# Altium project MCU098_LP-MSPM0G3507.PrjPcb (part 3 of 4)

## Sheet MCU098_04_XDS110-ET_EnergyTrace.SchDoc: XDS110-ET EnergyTrace
size 431 x 279 mm; Date: Not shown in title block; ApprovedBy: Not shown in title block; CheckedBy: Not shown in title block; Author: Not shown in title block; CompanyName: Not shown in title block; DrawnBy: Johnson He; Engineer: Not shown in title block; Organization: Not shown in title block; Address1: Not shown in title block; Address2: Not shown in title block; Address3: Not shown in title block; Address4: Not shown in title block; DocumentNumber: 2; Revision: Use project parameter SCH_Rev; SheetNumber: 4; SheetTotal: 7; PageSetup: Record=PageOptions|CenterHorizontal=True|CenterVertical=True|PrintScale=1.00|XCorrection=1.00|YCorrection=1.00|PrintKind=0|BorderSize=5000000|LeftOffset=0|BottomOffset=0|Orientation=2|PaperLength=1000|PaperWidth=1000|Scale=100|PaperSource=15|PrintQuality=600|MediaType=1|DitherType=10|PaperKind=Letter|PrintScaleMode=1; CurrentTime: Not shown in title block; CurrentDate: Not shown in title block; Time: Not shown in title block; DocumentFullPathAndName: Not shown in title block; DocumentName: Not shown in title block; ModifiedDate: Not shown in title block; ImagePath: Not shown in title block
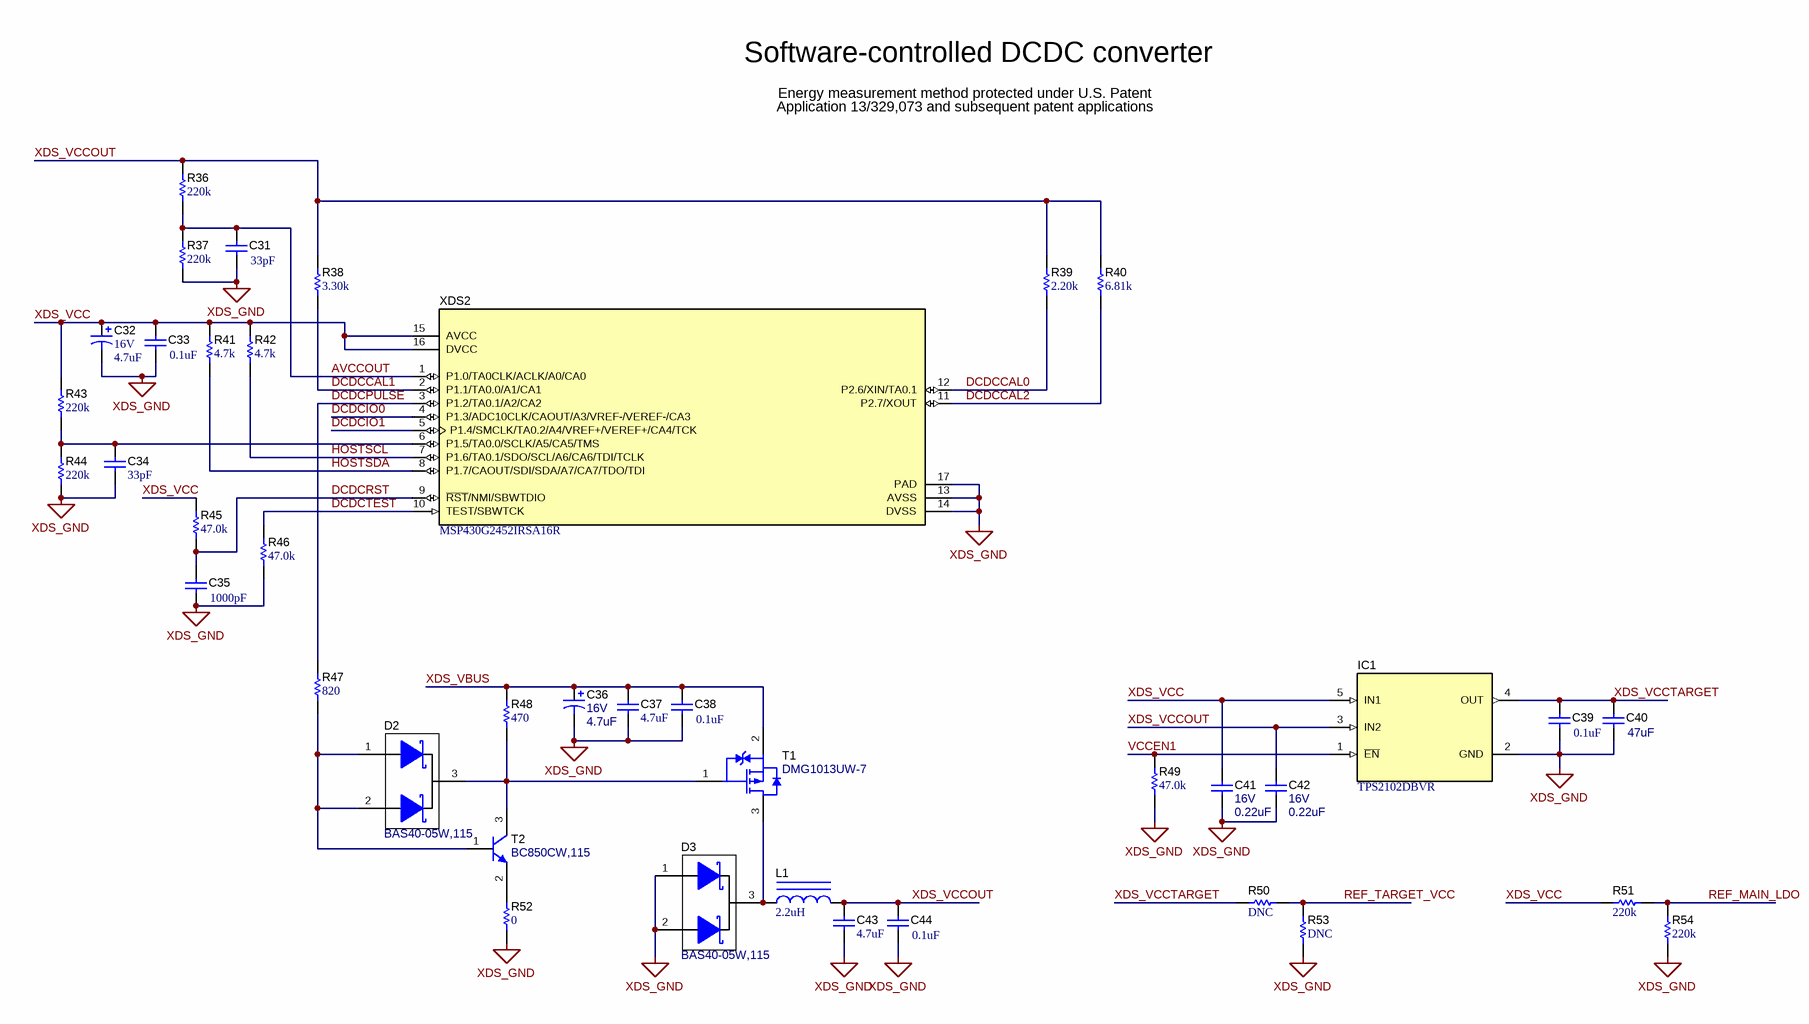
[diagram p3: MCU098_04_XDS110-ET_EnergyTrace.SchDoc]

### Parts
C31  ValueDisplayed: 33pF  [0402]  (hidden comment: GRM1555C1H330JA01D)
C32  VDC_V: 16V  ValueDisplayed: 4.7uF  [3216-18]  (hidden comment: TAJA475K016RNJ)
C33  ValueDisplayed: 0.1uF  [0402]  (hidden comment: GRM155R70J104KA01D)
C34  ValueDisplayed: 33pF  [0402]  (hidden comment: GRM1555C1H330JA01D)
C35  ValueDisplayed: 1000pF  [0402]  (hidden comment: GCM155R71H102KA37D)
C36  VDC_V: 16V  ValueDisplayed: 4.7uF  [3216-18]  (hidden comment: TAJA475K016RNJ)
C37  ValueDisplayed: 4.7uF  [0603]  (hidden comment: GRM188R61C475KAAJ)
C38  ValueDisplayed: 0.1uF  [0402]  (hidden comment: GRM155R70J104KA01D)
C39  ValueDisplayed: 0.1uF  [0402]  (hidden comment: GRM155R70J104KA01D)
C40  ValueDisplayed: 47uF  [0603]  (hidden comment: GRM188R60J476ME15D)
C41  VDC_V: 16V  ValueDisplayed: 0.22uF  [0402]  (hidden comment: GRM155R71C224KA12D)
C42  VDC_V: 16V  ValueDisplayed: 0.22uF  [0402]  (hidden comment: GRM155R71C224KA12D)
C43  ValueDisplayed: 4.7uF  [0603]  (hidden comment: GRM188R61C475KAAJ)
C44  ValueDisplayed: 0.1uF  [0402]  (hidden comment: GRM155R70J104KA01D)
D2  BAS40-05W,115  [SOT-323]
D3  BAS40-05W,115  [SOT-323]
IC1  TPS2102DBVR  [DBV0005A_N]
L1  ValueDisplayed: 2.2uH  [CBC2518]  (hidden comment: CBC2518T2R2M)
R36  ValueDisplayed: 220k  [0402]  (hidden comment: RC0402FR-07220KL)
R37  ValueDisplayed: 220k  [0402]  (hidden comment: RC0402FR-07220KL)
R38  ValueDisplayed: 3.30k  [0402]  (hidden comment: ERJ-2RKF3301X)
R39  ValueDisplayed: 2.20k  [0402]  (hidden comment: CRCW04022K20FKED)
R40  ValueDisplayed: 6.81k  [0402]  (hidden comment: CRCW04026K81FKED)
R41  ValueDisplayed: 4.7k  [0402]  (hidden comment: CRCW04024K70JNED)
R42  ValueDisplayed: 4.7k  [0402]  (hidden comment: CRCW04024K70JNED)
R43  ValueDisplayed: 220k  [0402]  (hidden comment: RC0402FR-07220KL)
R44  ValueDisplayed: 220k  [0402]  (hidden comment: RC0402FR-07220KL)
R45  ValueDisplayed: 47.0k  [0402]  (hidden comment: RC0402FR-0747KL)
R46  ValueDisplayed: 47.0k  [0402]  (hidden comment: RC0402FR-0747KL)
R47  ValueDisplayed: 820  [0402]  (hidden comment: RC0402FR-07820RL)
R48  ValueDisplayed: 470  [0402]  (hidden comment: CRCW0402470RJNED)
R49  ValueDisplayed: 47.0k  [0402]  (hidden comment: RC0402FR-0747KL)
R50  ValueDisplayed: DNC  [0402]  (hidden comment: RC0402FR-07220KL)  (no BOM)
R51  ValueDisplayed: 220k  [0402]  (hidden comment: RC0402FR-07220KL)
R52  ValueDisplayed: 0  [0603]  (hidden comment: RC0603JR-070RL)
R53  ValueDisplayed: DNC  [0402]  (hidden comment: RC0402FR-07220KL)  (no BOM)
R54  ValueDisplayed: 220k  [0402]  (hidden comment: RC0402FR-07220KL)
T1  DMG1013UW-7  [SOT-323]
T2  BC850CW,115  [SOT-323]
XDS2  MSP430G2452IRSA16R  [RSA0016B]

### Nets
XDS_GND: C31.2 C32.2(-) C33.2 C34.2 C35.2 C36.2(-) C37.1 C38.2 C39.2 C40.2 C41.2 C42.2 C43.1 C44.2 D3.1(A) D3.2(A) IC1.2(GND) R37.1 R44.1 R46.1 R49.1 R52.1 R53.1 R54.1 XDS2.13(AVSS) XDS2.14(DVSS) XDS2.17(PAD)
XDS_VCC: C32.1(+) C33.1 C41.1 IC1.5(IN1) R41.2 R42.2 R43.2 R45.2 R51.2 XDS2.15(AVCC) XDS2.16(DVCC)
AVCCOUT: C31.1 R36.1 R37.2 XDS2.1(P1.0/TA0CLK/ACLK/A0/CA0)
DCDCCAL0: R39.1 XDS2.12(P2.6/XIN/TA0.1)
DCDCCAL1: R38.1 XDS2.2(P1.1/TA0.0/A1/CA1)
DCDCCAL2: R40.1 XDS2.11(P2.7/XOUT)
DCDCIO0: XDS2.4(P1.3/ADC10CLK/CAOUT/A3/VREF-/VEREF-/CA3)
DCDCIO1: XDS2.5(P1.4/SMCLK/TA0.2/A4/VREF+/VEREF+/CA4/TCK)
DCDCPULSE: R47.2 XDS2.3(P1.2/TA0.1/A2/CA2)
DCDCRST: C35.1 R45.1 XDS2.9(~{RST}/NMI/SBWTDIO)
DCDCTEST: R46.2 XDS2.10(TEST/SBWTCK)
HOSTSCL: R42.1 XDS2.7(P1.6/TA0.1/SDO/SCL/A6/CA6/TDI/TCLK)
HOSTSDA: R41.1 XDS2.8(P1.7/CAOUT/SDI/SDA/A7/CA7/TDO/TDI)
REF_MAIN_LDO: R51.1 R54.2
REF_TARGET_VCC: R50.1 R53.2
VCCEN1: IC1.1(~{EN}) R49.2
XDS_VBUS: C36.1(+) C37.2 C38.1 R48.2 T1.2(S)
XDS_VCCOUT: C42.1 C43.2 C44.1 IC1.3(IN2) L1.2 R36.2 R38.2 R39.2 R40.2
XDS_VCCTARGET: C39.1 C40.1 IC1.4(OUT) R50.2
NetC34_1: C34.1 R43.1 R44.2 XDS2.6(P1.5/TA0.0/SCLK/A5/CA5/TMS)
NetD2_1: D2.1(A) D2.2(A) R47.1 T2.1(B)
NetD2_3: D2.3(K) R48.1 T1.1(G) T2.3(C)
NetD3_3: D3.3(K) L1.1 T1.3(D)
NetR52_2: R52.2 T2.2(E)

### Notes on the sheet
- Software-controlled DCDC converter
- Energy measurement method protected under U.S. Patent
- Application 13/329,073 and subsequent patent applications
- Drawn By:
- SVN Rev:
- Number:
- TID #:
- Orderable:
- Rev:
- Sheet Title:
- File:
- Project Title:
- Designed for:
- Assembly Variant:
- Mod. Date:
- Sheet:
- Size:
- of
- B
- http://www.ti.com
- Texas Instruments and/or its licensors do not warrant the accuracy or completeness of this specification or any information contained therein. Texas Instruments and/or its licensors do not warrant that this design will meet the specifications, will be suitable for your application or fit for any particular purpose, or will operate in an implementation. Texas Instruments and/or its licensors do not warrant that the design is production worthy. You should completely validate and test your design implementation to confirm the system functionality for your application.
- Engineer:
- Contact:
- © Texas Instruments

### Library data of the parts
C31 C34 = CMP-0006454-1: CAP, CERM, 33 pF, 50 V, +/- 5%, C0G/NP0, 0402; Manufacturer: MuRata; TaMin_C: -55°C; Polarized: N; SizeAreaWB_mm2: 3; Value1: Unknown; U/M: EA; Value: 33pF; TaMax_C: 125°C; SizeZ_mm: 0.6; SizeX_mm: 1; SizeY_mm: 0.5; Value2: 50V; AEC Category: Q200; ComponentLink1URL: http://search.murata.co.jp/Ceramy/PnsearchViewAction.do?HnOFG=ON&HnNFG=ON&SEL_CNT=50&sLang=en&sKey=GRM1555C1H330JA01D&x=9&y=9&search=startwith; Publisher: Texas Instruments; TempCo: C0G/NP0; Published: 2008-06-19; RoHS: Y; MountType: SMT; Supplier 1: Mouser; PackageReference: 0402; Tolerance_%: 5%; Cap_Case: 0402; SizeArea_mm2: 0.5; CompType: Capacitor; LatestRevisionDate: 2017-03-09; PartNumber: GRM1555C1H330JA01D; AEC Qualified: ?; Cap_F: 33pF; VDC_V: 50V; ComponentLink1Description: Datasheet link; Supplier Part Number 1: 81-GRM1555C1H330JA1D; Technology: Ceramic
C32 C36 = CMP-0011480-1: CAP, TA, 4.7 uF, 16 V, +/- 10%, 4 ohm, SMD; Manufacturer: AVX; TaMin_C: -55°C; ESR_ohm: 4; Polarized: Y; SizeAreaWB_mm2: 10.92; Value1: 4 ohm; U/M: EA; Value: 4.7uF; TaMax_C: 125°C; SizeZ_mm: 1.8; SizeX_mm: 3.2; SizeY_mm: 1.6; SizeArea_mm2: 5.12; CompType: Capacitor; AEC Qualified: N; Cap_F: 4.7µF; AEC Category: Q200; ComponentLink1URL: http://www.avx.com/docs/Catalogs/taj.pdf; Supplier Part Number 2: 60R5857; Publisher: Texas Instruments; Supplier 2: Newark; Supplier Part Number 3: 581-TAJA475K016R; Supplier 3: Mouser; RoHS: Y; MountType: SMT; Supplier 1: Digi-Key; LatestRevisionNote: Updated supplier links; PackageReference: 3216-18; Tolerance_%: 10%; Cap_Case: 3216-18; Value2: 16V; LatestRevisionDate: 2017-03-09; PartNumber: TAJA475K016RNJ; Series: TAJ; ComponentLink1Description: Datasheet link; AEC Grade: N/A; Supplier Part Number 1: 478-3868-1-ND; Technology: TA
C33 C38 C39 C44 = CMP-0006623-2: CAP, CERM, 0.1 uF, 6.3 V, +/- 10%, X7R, 0402; Manufacturer: MuRata; TaMin_C: -55°C; Polarized: N; SizeAreaWB_mm2: 3; Value1: Unknown; U/M: EA; Value: 0.1uF; TaMax_C: 125°C; SizeZ_mm: 0.6; SizeX_mm: 1; SizeY_mm: 0.5; Value2: 6.3V; Cap_F: 100nF; AEC Category: Q200; Supplier Part Number 2: 81-GRM155R70J104KA1D; Publisher: Texas Instruments; Supplier 2: Mouser; TempCo: X7R; Published: 2008-06-19; RoHS: Y; MountType: SMT; Supplier 1: Digi-Key; PackageReference: 0402; Tolerance_%: 10%; Cap_Case: 0402; SizeArea_mm2: 0.5; CompType: Capacitor; LatestRevisionDate: 2017-03-09; PartNumber: GRM155R70J104KA01D; AEC Qualified: ?; VDC_V: 6.3V; ComponentLink1Description: Datasheet link; Supplier Part Number 1: GRM155R70J104KA01D-ND; Technology: Ceramic; ComponentLink1URL: http://search.murata.co.jp/Ceramy/PnsearchViewAction.do?HnOFG=ON&HnNFG=ON&SEL_CNT=50&sLang=en&sKey=GRM155R70J104KA01D&x=9&y=9&search=startwith
C35 = CMP-0006354-2: CAP, CERM, 1000 pF, 50 V, +/- 10%, X7R, AEC-Q200 Grade 1, 0402; Manufacturer: MuRata; TaMin_C: -55°C; Polarized: N; SizeAreaWB_mm2: 3; Value1: Unknown; U/M: EA; Value: 1000pF; TaMax_C: 125°C; SizeZ_mm: 0.6; SizeX_mm: 1; SizeY_mm: 0.5; Value2: 50V; AEC Qualified: Y; Cap_F: 1nF; AEC Category: Q200; Supplier Part Number 2: 45Y5158; Publisher: Texas Instruments; Supplier 2: Newark; Supplier Part Number 3: 81-GCM155R71H102KA7D; TempCo: X7R; Supplier 3: Mouser; Published: 2008-06-19; RoHS: Y; MountType: SMT; Supplier 1: Digi-Key; PackageReference: 0402; Tolerance_%: 10%; Cap_Case: 0402; SizeArea_mm2: 0.5; CompType: Capacitor; LatestRevisionDate: 2017-03-09; PartNumber: GCM155R71H102KA37D; VDC_V: 50V; ComponentLink1Description: Datasheet link; AEC Grade: 1; Supplier Part Number 1: 490-4761-1-ND; Technology: Ceramic; ComponentLink1URL: http://psearch.en.murata.com/capacitor/product/GCM155R71H102KA37%23.pdf
C37 C43 = CMP-0007341-4: CAP, CERM, 4.7 uF, 16 V, +/- 10%, X5R, 0603; Manufacturer: MuRata; TaMin_C: -55°C; Polarized: N; SizeAreaWB_mm2: 4.68; Value1: Unknown; U/M: EA; Value: 4.7uF; TaMax_C: 85°C; SizeZ_mm: 1; SizeX_mm: 1.6; SizeY_mm: 0.8; Value2: 16V; SizeArea_mm2: 1.28; Cap_F: 4.7µF; AEC Category: Q200; Supplier Part Number 2: 81-GRM188R61C475KAJD; Publisher: Texas Instruments; Supplier 2: Mouser; TempCo: X5R; Published: 2008-06-19; RoHS: Y; MountType: SMT; Supplier 1: Digi-Key; PackageReference: 0603; Tolerance_%: 10%; Cap_Case: 0603; CompType: Capacitor; LatestRevisionDate: 2017-03-09; PartNumber: GRM188R61C475KAAJ; AEC Qualified: N; VDC_V: 16V; ComponentLink1Description: Datasheet link; AEC Grade: N/A; Supplier Part Number 1: 490-10481-1-ND; Technology: Ceramic; ComponentLink1URL: http://psearch.murata.com/capacitor/product/GRM188R61C475KAAJ%23.pdf
C40 = CMP-0007313-1: CAP, CERM, 47 uF, 6.3 V, +/- 20%, X5R, 0603; Manufacturer: MuRata; TaMin_C: -55°C; Polarized: N; SizeAreaWB_mm2: 4.68; Value1: Unknown; U/M: EA; Value: 47uF; TaMax_C: 85°C; SizeZ_mm: 1; SizeX_mm: 1.6; SizeY_mm: 0.8; Value2: 6.3V; SizeArea_mm2: 1.28; Cap_F: 47µF; AEC Category: Q200; ComponentLink1URL: http://psearch.en.murata.com/capacitor/product/GRM188R60J476ME15%23.pdf; Publisher: Texas Instruments; TempCo: X5R; Published: 2008-06-19; RoHS: Y; MountType: SMT; PackageReference: 0603; Tolerance_%: 20%; Cap_Case: 0603; CompType: Capacitor; LatestRevisionDate: 2017-03-09; PartNumber: GRM188R60J476ME15D; AEC Qualified: ?; VDC_V: 6.3V; ComponentLink1Description: Datasheet link; Technology: Ceramic
C41 C42 = CMP-0006648-1: CAP, CERM, 0.22 uF, 16 V, +/- 10%, X7R, 0402; Manufacturer: MuRata; TaMin_C: -55°C; Polarized: N; SizeAreaWB_mm2: 3; Value1: Unknown; U/M: EA; Value: 0.22uF; TaMax_C: 125°C; SizeZ_mm: 0.6; SizeX_mm: 1; SizeY_mm: 0.5; Cap_F: 220nF; AEC Category: Q200; ComponentLink1URL: http://search.murata.co.jp/Ceramy/PnsearchViewAction.do?HnOFG=ON&HnNFG=ON&SEL_CNT=50&sLang=en&sKey=GRM155R71C224KA12D&x=9&y=9&search=startwith; Supplier Part Number 2: 81-GRM155R71C224KA2D; Publisher: Texas Instruments; Supplier 2: Mouser; TempCo: X7R; Published: 2008-06-19; RoHS: Y; MountType: SMT; Supplier 1: Digi-Key; PackageReference: 0402; Tolerance_%: 10%; Cap_Case: 0402; Value2: 16V; SizeArea_mm2: 0.5; CompType: Capacitor; LatestRevisionDate: 2017-03-09; PartNumber: GRM155R71C224KA12D; AEC Qualified: ?; ComponentLink1Description: Datasheet link; Supplier Part Number 1: 490-5418-1-ND; Technology: Ceramic
D2 D3 = CMP-0028883-1: Diode, Schottky, 40 V, 0.12 A, AEC-Q101, SOT-323; Manufacturer: Nexperia; Io_A: 120mA; Green_Lifecycle: Not Set; SizeAreaWB_mm2: 10.24; Vr_V: 40V; Green_REACh: Incomplete; Value1: 0.12A; TJmax_C: 150°C; U/M: EA; Value: 40V; SizeZ_mm: 1.1; SizeX_mm: 2.2; Vf_V: 1V; SizeArea_mm2: 4.84; AEC Qualified: Y; AEC Category: Q101; ComponentLink1URL: http://www.nexperia.com/documents/data_sheet/BAS40_1PSXXSB4X_SER.pdf; Supplier Part Number 2: 70R1987; Publisher: Texas Instruments; Supplier 2: Newark; Supplier Part Number 3: 771-BAS40-05W115; Supplier 3: Mouser; Published: 2008-06-26; RoHS: Y; MountType: SMT; Green_EU RoHS-2: Incomplete; Supplier 1: Digi-Key; Green_EU RoHS: Incomplete; PackageReference: SOT-323; SizeY_mm: 2.2; Value2: 1V; CompType: Diode; Type: Schottky; LatestRevisionDate: 2017-05-08; PartNumber: BAS40-05W,115; ComponentLink1Description: Datasheet link; Supplier Part Number 1: 568-7982-1-ND
IC1 = CMP-0074212-1: 2.7-4V Dual In/Single Out MOSFET, 0.5A Main/0.1A Aux Input, Act-Low Enable, Comm. Temp., DBV0005A (SOT-23-5); Alternate PartNumber: TPS2102DBVT; Alternate Manufacturer: Texas Instruments; SizeAreaWB_mm2: 14.82; U/M: EA; SizeZ_mm: 1.45; SizeX_mm: 2.8; SizeY_mm: 2.9; SizeArea_mm2: 8.12; CompType: IC; ComponentLink1URL: http://www.ti.com/lit/ds/symlink/tps2102.pdf; Publisher: Texas Instruments; PackageDescription: SOT-23-5; RoHS: Y; Footprint Path 6: C:\AltiumLibraries\Footprints\TI\.PcbLib; MountType: SMT; Manufacturer: Texas Instruments; PackageReference: DBV0005A; LatestRevisionDate: 2017-06-09; PartNumber: TPS2102DBVR; ComponentLink1Description: Datasheet Link
L1 = CMP-0059590-1: Inductor, Wirewound, Ceramic, 2.2 uH, 0.89 A, 0.13 ohm, SMD; Manufacturer: Taiyo Yuden; Isat: 0.89A @ 30% inductance drop; Irms: 1.1A @ 40C rise; Green_Lifecycle: Active; SizeAreaWB_mm2: 9.8; DCR_ohm: 0.13; Green_REACh: Passed; Value: 2.2uH; Imax_A: 890mA; SizeZ_mm: 1.8; SizeX_mm: 2.5; Value2: 0.89A; SizeArea_mm2: 4.5; Ind_H: 2.2µH; AEC Qualified: N; AEC Category: Q200; ComponentLink1URL: http://www.yuden.co.jp/productdata/catalog/en/wound02_e.pdf; Supplier Part Number 2: 18J0834; Publisher: Texas Instruments; Supplier 2: Newark; Supplier Part Number 3: 963-CBC2518T2R2M; Supplier 3: Mouser; Published: 2008-06-26; RoHS: Y; Value1: 0.13 ohm; Material: Ceramic; MountType: SMT; Green_EU RoHS-2: Passed; Supplier 1: Digi-Key; Green_EU RoHS: Passed; PackageReference: 2.5x1.8x1.8mm; SizeY_mm: 1.8; CompType: Inductor; LatestRevisionDate: 2017-06-02; PartNumber: CBC2518T2R2M; ComponentLink1Description: Datasheet link; AEC Grade: N/A; Supplier Part Number 1: 587-1618-1-ND; Technology: Wirewound
R36 R37 R43 R44 R51 R54 = CMP-0026728-1: RES, 220 k, 1%, 0.0625 W, 0402; Manufacturer: Yageo America; Power_W: 62.5mW; TempCo: 100 ppm/C; U/M: EA; Value: 220k; SizeX_mm: 1; SizeY_mm: 0.5; SizeZ_mm: 0.6; AEC Qualified: N; VDC_V: 50V; AEC Category: Q200; ComponentLink1URL: http://www.yageo.com/documents/recent/PYu-RC0402_51_RoHS_L_6_r.pdf; Supplier Part Number 2: 98K7527; Publisher: Texas Instruments; Supplier 2: Newark; Supplier Part Number 3: 603-RC0402FR-07220KL; Supplier 3: Mouser; Published: 2008-06-26; Value_Code: 220k; RoHS: Y; Value1: 1%; MountType: SMT; Supplier 1: Digi-Key; PackageReference: 0402; Tolerance_%: 1%; Res_ohm: 220k; Value2: 0.0625W; SizeArea_mm2: 0.5; CompType: Resistor; LatestRevisionDate: 2017-03-09; PartNumber: RC0402FR-07220KL; ComponentLink1Description: Datasheet link; AEC Grade: N/A; Supplier Part Number 1: 311-220KLRCT-ND; Technology: Thick Film
R38 = CMP-0026695-1: RES, 3.30 k, 1%, 0.1 W, AEC-Q200 Grade 0, 0402; Manufacturer: Panasonic; Power_W: 100mW; TempCo: 100 ppm/C; Value_Code: 3k30; U/M: EA; Value: 3.30k; Res_ohm: 3.3k; SizeX_mm: 1; SizeY_mm: 0.5; SizeZ_mm: 0.6; Value2: 0.1W; AEC Qualified: Y; VDC_V: 50V; AEC Grade: 0; AEC Category: Q200; ComponentLink1URL: http://industrial.panasonic.com/cdbs/www-data/pdf/RDA0000/AOA0000C86.pdf; Supplier Part Number 2: 64R5278; Publisher: Texas Instruments; Supplier 2: Newark; Supplier Part Number 3: 667-ERJ-2RKF3301X; Supplier 3: Mouser; Published: 2008-06-26; RoHS: Y; Value1: 1%; MountType: SMT; Supplier 1: Digi-Key; PackageReference: 0402; Tolerance_%: 1%; SizeArea_mm2: 0.5; CompType: Resistor; LatestRevisionDate: 2017-03-09; PartNumber: ERJ-2RKF3301X; ComponentLink1Description: Datasheet link; Supplier Part Number 1: P3.30KLCT-ND; Technology: Thick Film
R39 = CMP-0026231-1: RES, 2.20 k, 1%, 0.063 W, 0402; Manufacturer: Vishay-Dale; Power_W: 63mW; TempCo: 100 ppm/C; Value_Code: 2k20; U/M: EA; Value: 2.20k; Res_ohm: 2.2k; SizeX_mm: 1; SizeY_mm: 0.5; SizeZ_mm: 0.6; Value2: 0.063W; AEC Category: Q200; ComponentLink1URL: http://www.vishay.com/docs/20035/dcrcwe3.pdf; Supplier Part Number 2: 26W9020; Publisher: Texas Instruments; Supplier 2: Newark; Supplier Part Number 3: 71-CRCW0402-2.2K-E3; Supplier 3: Mouser; Published: 2008-06-26; RoHS: Y; Value1: 1%; MountType: SMT; Supplier 1: Digi-Key; PackageReference: 0402; Tolerance_%: 1%; SizeArea_mm2: 0.5; CompType: Resistor; LatestRevisionDate: 2017-03-09; PartNumber: CRCW04022K20FKED; AEC Qualified: ?; ComponentLink1Description: Datasheet link; Supplier Part Number 1: 541-2.20KLCT-ND; Technology: Thick Film
R40 = CMP-0026517-1: RES, 6.81 k, 1%, 0.063 W, 0402; Manufacturer: Vishay-Dale; Power_W: 63mW; TempCo: 100 ppm/C; Value_Code: 6k81; U/M: EA; Value: 6.81k; EIA_Code: E96; SizeX_mm: 1; SizeY_mm: 0.5; SizeZ_mm: 0.6; Value2: 0.063W; VDC_V: 50V; AEC Category: Q200; ComponentLink1URL: http://www.vishay.com/docs/20035/dcrcwe3.pdf; Supplier Part Number 2: 52K7188; Publisher: Texas Instruments; Supplier 2: Newark; Supplier Part Number 3: 71-CRCW0402-6.81K-E3; Supplier 3: Mouser; Published: 2008-06-26; RoHS: Y; Value1: 1%; MountType: SMT; Supplier 1: Digi-Key; PackageReference: 0402; Tolerance_%: 1%; Res_ohm: 6.81k; SizeArea_mm2: 0.5; CompType: Resistor; LatestRevisionDate: 2017-03-09; PartNumber: CRCW04026K81FKED; AEC Qualified: ?; ComponentLink1Description: Datasheet link; Supplier Part Number 1: 541-6.81KLCT-ND; Technology: Thick Film
R41 R42 = CMP-0026938-1: RES, 4.7 k, 5%, 0.063 W, 0402; Manufacturer: Vishay-Dale; Power_W: 63mW; TempCo: 200 ppm/C; Value_Code: 4k70; U/M: EA; Value: 4.7k; EIA_Code: E24; SizeX_mm: 1; SizeY_mm: 0.5; SizeZ_mm: 0.6; Value2: 0.063W; VDC_V: 50V; AEC Category: Q200; ComponentLink1URL: http://www.vishay.com/docs/20035/dcrcwe3.pdf; Supplier Part Number 2: 59M6733; Publisher: Texas Instruments; Supplier 2: Newark; Supplier Part Number 3: 71-CRCW0402J-4.7K-E3; Supplier 3: Mouser; Published: 2008-06-26; RoHS: Y; Value1: 5%; MountType: SMT; Supplier 1: Digi-Key; PackageReference: 0402; Tolerance_%: 5%; Res_ohm: 4.7k; SizeArea_mm2: 0.5; CompType: Resistor; LatestRevisionDate: 2017-03-09; PartNumber: CRCW04024K70JNED; AEC Qualified: ?; ComponentLink1Description: Datasheet link; Supplier Part Number 1: 541-4.7KJCT-ND; Technology: Thick Film
R45 R46 R49 = CMP-0026737-1: RES, 47.0 k, 1%, 0.0625 W, 0402; Manufacturer: Yageo America; Power_W: 62.5mW; TempCo: 100 ppm/C; Value_Code: 47k0; U/M: EA; Value: 47.0k; Res_ohm: 47k; SizeX_mm: 1; SizeY_mm: 0.5; SizeZ_mm: 0.6; AEC Qualified: N; VDC_V: 50V; AEC Category: Q200; ComponentLink1URL: http://www.yageo.com/documents/recent/PYu-RC0402_51_RoHS_L_6_r.pdf; Supplier Part Number 2: 67R9937; Publisher: Texas Instruments; Supplier 2: Newark; Supplier Part Number 3: 603-RC0402FR-0747KL; Supplier 3: Mouser; Published: 2008-06-26; RoHS: Y; Value1: 1%; MountType: SMT; Supplier 1: Digi-Key; PackageReference: 0402; Tolerance_%: 1%; Value2: 0.0625W; SizeArea_mm2: 0.5; CompType: Resistor; LatestRevisionDate: 2017-03-09; PartNumber: RC0402FR-0747KL; ComponentLink1Description: Datasheet link; AEC Grade: N/A; Supplier Part Number 1: 311-47.0KLRCT-ND; Technology: Thick Film
R47 = CMP-0026743-1: RES, 820, 1%, 0.063 W, 0402; Manufacturer: Yageo America; Power_W: 63mW; TempCo: 100 ppm/C; Value_Code: 820R; U/M: EA; Value: 820; SizeX_mm: 1; SizeY_mm: 0.5; SizeZ_mm: 0.6; Value2: 0.063W; AEC Qualified: N; VDC_V: 50V; AEC Category: Q200; ComponentLink1URL: http://www.yageo.com/documents/recent/PYu-RC_Group_51_RoHS_L_04.pdf; Supplier Part Number 2: 26M6794; Publisher: Texas Instruments; Supplier 2: Newark; Supplier Part Number 3: 603-RC0402FR-07820RL; Supplier 3: Mouser; Published: 2008-06-26; RoHS: Y; Value1: 1%; MountType: SMT; Supplier 1: Digi-Key; PackageReference: 0402; Tolerance_%: 1%; Res_ohm: 820; SizeArea_mm2: 0.5; CompType: Resistor; LatestRevisionDate: 2017-03-09; PartNumber: RC0402FR-07820RL; ComponentLink1Description: Datasheet link; AEC Grade: N/A; Supplier Part Number 1: 311-820LRCT-ND; Technology: Thick Film
R48 = CMP-0026934-1: RES, 470, 5%, 0.063 W, 0402; Manufacturer: Vishay-Dale; Power_W: 63mW; TempCo: 200 ppm/C; Value_Code: 470R; U/M: EA; Value: 470; EIA_Code: E24; SizeX_mm: 1; SizeY_mm: 0.5; SizeZ_mm: 0.6; Value2: 0.063W; VDC_V: 50V; AEC Category: Q200; ComponentLink1URL: http://www.vishay.com/docs/20035/dcrcwe3.pdf; Supplier Part Number 2: 59M6737; Publisher: Texas Instruments; Supplier 2: Newark; Supplier Part Number 3: 71-CRCW0402J-470-E3; Supplier 3: Mouser; Published: 2008-06-26; RoHS: Y; Value1: 5%; MountType: SMT; Supplier 1: Digi-Key; PackageReference: 0402; Tolerance_%: 5%; Res_ohm: 470; SizeArea_mm2: 0.5; CompType: Resistor; LatestRevisionDate: 2017-03-09; PartNumber: CRCW0402470RJNED; AEC Qualified: ?; ComponentLink1Description: Datasheet link; Supplier Part Number 1: 541-470JCT-ND; Technology: Thick Film
R50 R53 = CMP-0026728-1: RES, 220 k, 1%, 0.0625 W, 0402; Manufacturer: Yageo America; Power_W: 62.5mW; TempCo: 100 ppm/C; Value_Code: 220k; U/M: EA; Value: 220k; SizeX_mm: 1; SizeY_mm: 0.5; SizeZ_mm: 0.6; AEC Qualified: N; VDC_V: 50V; AEC Category: Q200; ComponentLink1URL: http://www.yageo.com/documents/recent/PYu-RC0402_51_RoHS_L_6_r.pdf; Supplier Part Number 2: 98K7527; Publisher: Texas Instruments; Supplier 2: Newark; Supplier Part Number 3: 603-RC0402FR-07220KL; Supplier 3: Mouser; Published: 2008-06-26; RoHS: Y; Value1: 1%; MountType: SMT; Supplier 1: Digi-Key; PackageReference: 0402; Tolerance_%: 1%; Res_ohm: 220k; Value2: 0.0625W; SizeArea_mm2: 0.5; CompType: Resistor; LatestRevisionDate: 2017-03-09; PartNumber: RC0402FR-07220KL; ComponentLink1Description: Datasheet link; AEC Grade: N/A; Supplier Part Number 1: 311-220KLRCT-ND; Technology: Thick Film
R52 = CMP-0025885-5: RES, 0, 5%, 0.1 W, 0603; Manufacturer: Yageo; Power_W: 100mW; TempCo: 200 ppm/C; Value_Code: 0000; Value: 0; EIA_Code: E24; SizeX_mm: 1.6; SizeZ_mm: 1; Value2: 0.1W; SizeArea_mm2: 1.28; AEC Qualified: N; VDC_V: 75V; AEC Category: Q200; SizeY_mm: 0.8; SizeAreaWB_mm2: 4.68; Supplier Part Number 2: 603-RC0603JR-070RL; Supplier 2: Mouser; Supplier Part Number 3: 9233130; Supplier 3: Farnell; RoHS: Y; Value1: 5%; MountType: SMT; Supplier 1: Digi-Key; PackageReference: 0603; Tolerance_%: 5%; Res_ohm: 0; CompType: Resistor; PartNumber: RC0603JR-070RL; ComponentLink1Description: Datasheet link; Supplier Part Number 1: 311-0.0GRCT-ND; Technology: Thick Film; ComponentLink1URL: http://www.yageo.com/pdf/Pu-RC0603_51_PbFree_L_2.pdf; AEC Grade: N/A
T1 = CMP-0000035-1: MOSFET, P-CH, -20 V, -0.82 A, SOT-323; Alternate Manufacturer: None; Manufacturer: Diodes Inc.; SizeZ_mm: 1.1; ChType: P; Value2: 0.622 nC; Value1: 0.7; VdsMax_V: -20V; SizeX_mm: 2.2; Vgs_V: -6V; Value: -20V; Rdson45_ohm: 0.75; SizeArea_mm2: 4.84; AEC Category: Q101; IdsMax_A: -820mA; SizeAreaWB_mm2: 10.24; U/M: EA; QgTyp_nC: 0.622; Supplier 2: Mouser; Supplier 1: Digi-Key; Supplier Part Number 1: DMG1013UW-7DICT-ND; Supplier Part Number 2: 621-DMG1013UW-7; PartNumber: DMG1013UW-7; ComponentLink1Description: Datasheet link; LatestRevisionDate: 2017-03-09; ComponentLink1URL: http://www.diodes.com/datasheets/ds31861.pdf; SizeY_mm: 2.2; CompType: MOSFET; PackageReference: SOT-323; LatestRevisionNote: Added parts.; Publisher: Texas Instruments; AEC Qualified: ?; Published: 2008-06-19; RoHS: Y; MountType: SMT
T2 = CMP-0000466-1: Transistor, NPN, 45 V, 0.1 A, SOT-323; Manufacturer: NXP Semiconductor; TaMax_C: 150°C; Value2: 800; Value1: 0.1 A; Vcesat1_V: 250mV; SizeX_mm: 2.2; TaMin_C: -65°C; IcRated_A: 100mA; CompType: BJT; SizeZ_mm: 1.1; Value: 45 V; SizeArea_mm2: 4.84; NPN: 1; Vceo_V: 45V; PNP: 0; AEC Category: Q101; SizeAreaWB_mm2: 10.24; U/M: EA; Supplier 2: Newark; Supplier 3: Mouser; Supplier 1: Digi-Key; Supplier Part Number 1: 568-6076-1-ND; Supplier Part Number 2: 75R0746; Supplier Part Number 3: 771-BC850CW-T/R; PartNumber: BC850CW,115; LatestRevisionDate: 2017-03-09; ComponentLink1URL: http://www.nxp.com/documents/data_sheet/BC849W_850W.pdf; SizeY_mm: 2.2; Publisher: Texas Instruments; AEC Qualified: ?; ComponentLink1Description: Datasheet link; HfeMax: 800; Published: 2008-07-31; RoHS: Y; PackageReference: SOT-323; MountType: SMT
XDS2 = CMP-0039611-2: MSP430G2x52, MSP430G2x12 Mixed Signal Microcontroller, RSA0016B (VQFN-16); Manufacturer: Texas Instruments; Alternate PartNumber: MSP430G2452IRSA16T; Eco-Plan: Green (RoHS & no Sb/Br); ADC: 10-bit SAR; SRAM(B): 256; Temp Sensor: Yes; Frequency(MHz): 16; ADC Channels: 8; Timers - 16-bit: 1; AEC Category: Q200; AEC Qualified: N; CompType: IC; Rating: Catalog; SizeAreaWB_mm2: 25; SizeX_mm: 4; DatasheetVersion: SLAS722E; ComponentLink1Description: Datasheet Link; ComponentLink3Description: Online Datasheet; Code_JEDEC: MO-220; ComponentLink2URL: http://www.ti.com/product/msp430g2452; Brown Out Reset: Yes; PackageReference: RSA0016B; PartNumber: MSP430G2452IRSA16R; Watchdog: Yes; Comparators: Yes; Flash(KB): 8; Cap touch I/O: Yes; ComponentLink3URL: http://www.ti.com/product/msp430g2452/datasheet; ComponentLink1URL: http://www.ti.com/lit/ds/symlink/msp430g2452.pdf; PackageDescription: VQFN-16; GPIO: 16; ComponentLink2Description: Product Folder; MountType: SMT; Operating Temperature Range: -40 to 85 C; RoHS: Y; SizeArea_mm2: 16; SizeY_mm: 4; SizeZ_mm: 1

## Sheet MCU098_05_XDS110_Target_Interface.SchDoc: XDS110-ET Interface
size 431 x 279 mm; DrawnBy: Johnson He; SheetNumber: 5; SheetTotal: 7; PageSetup: Record=PageOptions|CenterHorizontal=True|CenterVertical=True|PrintScale=0.97|XCorrection=1.00|YCorrection=1.00|PrintKind=0|BorderSize=5000000|LeftOffset=0|BottomOffset=0|Orientation=2|PaperLength=1000|PaperWidth=1000|Scale=100|PaperSource=15|PrintQuality=600|MediaType=1|DitherType=10|PaperKind=Letter|PrintScaleMode=1
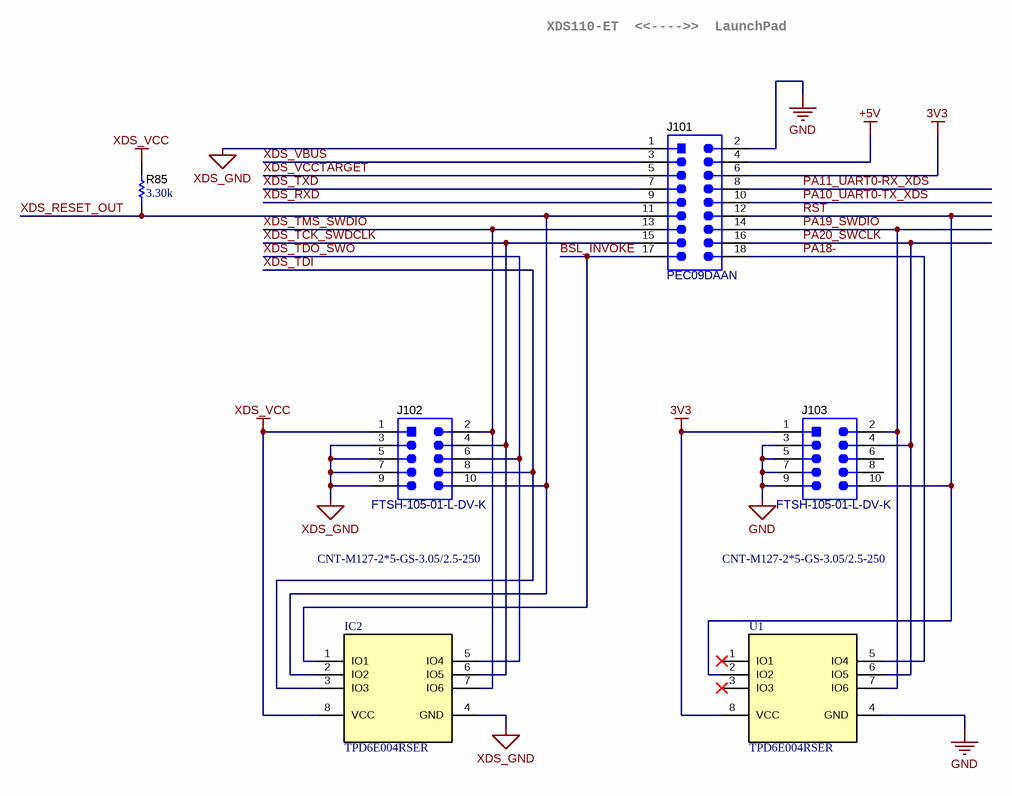
[diagram p4: MCU098_05_XDS110_Target_Interface.SchDoc]

### Parts
IC2  TPD6E004RSER  [RSE0008A]
J101  PEC09DAAN  [Sullins_PxC09DAAN]
J102  FTSH-105-01-L-DV-K  [Samtec_FTSH-105-01-x-DV-K]
J103  FTSH-105-01-L-DV-K  [Samtec_FTSH-105-01-x-DV-K]
R85  ValueDisplayed: 3.30k  [0402]  (hidden comment: ERJ-2RKF3301X)
U1  TPD6E004RSER  [RSE0008A]

### Nets
3V3: J101.6 J103.1 U1.8(VCC)
+5V: J101.4
GND: J101.2 J103.3 J103.5 J103.7 J103.9 U1.4(GND)
XDS_GND: IC2.4(GND) J101.1 J102.3 J102.5 J102.7 J102.9
XDS_VCC: IC2.8(VCC) J102.1 R85.2
BSL_INVOKE: IC2.1(IO1) J101.17
PA10_UART0-TX_XDS: J101.10
PA11_UART0-RX_XDS: J101.8
PA18-: J101.18 U1.5(IO4)
PA19_SWDIO: J101.14 J103.2 U1.7(IO6)
PA20_SWCLK: J101.16 J103.4 U1.6(IO5)
~{RST}: J101.12 J103.10 U1.2(IO2)
XDS_RESET_OUT: IC2.2(IO2) J101.11 J102.10 R85.1
XDS_RXD: J101.9
XDS_TCK_SWDCLK: IC2.6(IO5) J101.15 J102.4
XDS_TDI: IC2.3(IO3) J102.8
XDS_TDO_SWO: IC2.5(IO4) J102.6
XDS_TMS_SWDIO: IC2.7(IO6) J101.13 J102.2
XDS_TXD: J101.7
XDS_VBUS: J101.3
XDS_VCCTARGET: J101.5

Not connected (* = marked no-connect by the designer): J103 6 8; U1 1(IO1)* 3(IO3)*

### Notes on the sheet
- XDS110-ET  <<---->>  LaunchPad
- CNT-M127-2*5-GS-3.05/2.5-250
- Drawn By:
- SVN Rev:
- Number:
- TID #:
- Orderable:
- Rev:
- Sheet Title:
- File:
- Project Title:
- Designed for:
- Assembly Variant:
- Mod. Date:
- Sheet:
- Size:
- of
- B
- http://www.ti.com
- Texas Instruments and/or its licensors do not warrant the accuracy or completeness of this specification or any information contained therein. Texas Instruments and/or its licensors do not warrant that this design will meet the specifications, will be suitable for your application or fit for any particular purpose, or will operate in an implementation. Texas Instruments and/or its licensors do not warrant that the design is production worthy. You should completely validate and test your design implementation to confirm the system functionality for your application.
- Engineer:
- Contact:
- © Texas Instruments

### Library data of the parts
IC2 U1 = CMP-0043125-2: Low-Capacitance + / - 15 kV ESD Protection Array for High-Speed Data Interfaces, 6 Channels, -40 to +85 degC, 8-pin UQFN (RSE), Green (RoHS & no Sb/Br); Manufacturer: Texas Instruments; IO Leakage Current(nA): 1; IO Capacitance(Typ)(pF): 1.6; 1394 / Firewire: TRUE; SubFamily: ESD Solution; Breakdown Voltage(Min)(V): 6; IEC 61000-4-2 Air-Gap(+/- kV): 12; IEC 61000-4-2 Contact(+/- kV): 8; ComponentLink1URL: http://www.ti.com/; PackageDescription: 8-Pin Plastic Quad Flatpack No-Lead, 1.5 x 1.5 mm Body, 0.5 mm Pitch; Serial ATA / eSATA: TRUE; ComponentLink2URL: http://www.ti.com/general/docs/lit/getliterature.tsp?genericPartNumber=TPD6E004&fileType=pdf; ComponentLink3Description: URL Link1; Eco-Plan: Green (RoHS & no Sb/Br); USB High Speed: TRUE; ComponentLink2Description: Datasheet; ComponentLink3URL: SamplesURL:http://www.ti.com/product/tpd6e004#samples; PackageReference: RSE0008A; DatasheetVersion: SLLS799A; PartNumber: TPD6E004RSER; PackageVersion: revD, Jan-2011; Mounting Technology: Surface Mount; ComponentLink1Description: Manufacturer URL
J101 = CMP-0054622-1: Header, 2.54mm, 9x2, Tin, TH; Manufacturer: Sullins Connector Solutions; CNHeader: TRUE; Current_A: 3A; Shrouded: N; Gender: Male; Row_Count: 2; RowSpacing_mm: 2.54; CT: FALSE; Cert_UL: Y; ComponentLink1URL: http://www.sullinscorp.com/catalogs/77_PAGE108-109_.100_MALE_HDR.pdf; ClassName: Header; Publisher: Texas Instruments; Color: Black; RoHS: Y; MountType: TH; Supplier 1: Digi-Key; PackageReference: Header, 2.54mm, 9x2, TH; PinCount: 18; CompType: Header; LatestRevisionDate: 26/05/2017; PartNumber: PEC09DAAN; Orientation: Vertical; ComponentLink1Description: Datasheet URL; Supplier Part Number 1: S2012E-09-ND; Pitch_mm: 2.54; ContactFinish: Tin
J102 J103 = CMP-0075634-1: Header(Shrouded), 1.27mm, 5x2, Gold, SMT; Manufacturer: Samtec; Pitch_mm: 1.27; Gender: Male; Cert_CSA: Y; Current_A: 3.3A; CT: False; Row_Count: 2; ComponentLink1Description: Datasheet URL; RoHS: Y; Supplier 1: Digi-Key; Cert_UL: Y; Orientation: Vertical; PackageReference: Header(Shrouded), 1.27mm, 5x2, SMT; Color: Black; PartNumber: FTSH-105-01-L-DV-K; PinCount: 10; Publisher: Texas Instruments; Supplier Part Number 2: 1872577; ContactFinish: Gold; Supplier 2: Farnell; Shrouded: Y; RowSpacing_mm: 1.27; ComponentLink1URL: http://suddendocs.samtec.com/prints/ftsh-1xx-xx-xxx-dv-xxx-mkt.pdf; LatestRevisionDate: 2017-07-12; CompType: Header; CNHeader: False; MountType: SMT; Supplier Part Number 1: SAM8799-ND
R85 = CMP-0026695-1: as R38 on sheet MCU098_04_XDS110-ET_EnergyTrace; ComponentLink1URL: http://industrial.panasonic.com/cdbs/www-data/pdf/RDA0000/AOA0000C86.pdf; Supplier Part Number 2: 64R5278; Publisher: Texas Instruments; Supplier 2: Newark; Supplier Part Number 3: 667-ERJ-2RKF3301X; Supplier 3: Mouser; Published: 2008-06-26; RoHS: Y; Value1: 1%; MountType: SMT; Supplier 1: Digi-Key; PackageReference: 0402; Tolerance_%: 1%; SizeArea_mm2: 0.5; CompType: Resistor; LatestRevisionDate: 2017-03-09; PartNumber: ERJ-2RKF3301X; ComponentLink1Description: Datasheet link; Supplier Part Number 1: P3.30KLCT-ND; Technology: Thick Film

## Sheet MCU098_06_XDS110-ET_USB_Power.SchDoc: XDS110-ET USB Power
size 431 x 279 mm; DrawnBy: Johnson He; SheetNumber: 6; SheetTotal: 7; PageSetup: Record=PageOptions|CenterHorizontal=True|CenterVertical=True|PrintScale=0.97|XCorrection=1.00|YCorrection=1.00|PrintKind=0|BorderSize=5000000|LeftOffset=0|BottomOffset=0|Orientation=2|PaperLength=1000|PaperWidth=1000|Scale=100|PaperSource=15|PrintQuality=600|MediaType=1|DitherType=10|PaperKind=Letter|PrintScaleMode=1
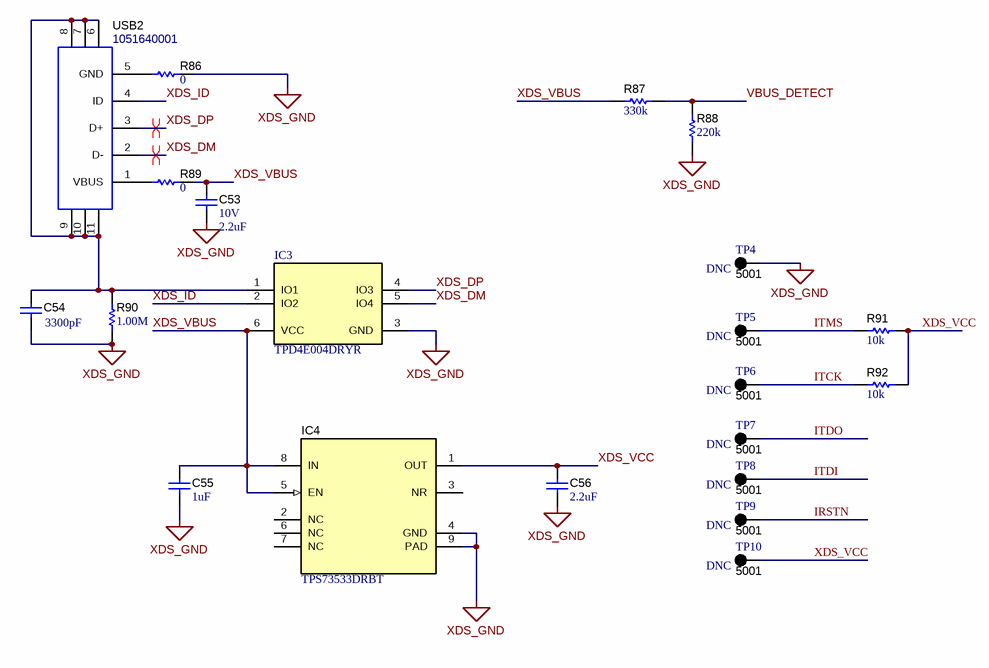
[diagram p5: MCU098_06_XDS110-ET_USB_Power.SchDoc]

### Parts
C53  VDC_V: 10V  ValueDisplayed: 2.2uF  [0603]  (hidden comment: C0603C225K8PACTU)
C54  ValueDisplayed: 3300pF  [0402]  (hidden comment: GRM155R71H332KA01D)
C55  ValueDisplayed: 1uF  [0402]  (hidden comment: C1005X5R1E105K050BC)
C56  ValueDisplayed: 2.2uF  [0402]  (hidden comment: GRM155R60J225KE95D)
IC3  TPD4E004DRYR  [DRY0006A]
IC4  TPS73533DRBT  [DRB0008A]
R86  ValueDisplayed: 0  [0603]  (hidden comment: RC0603JR-070RL)
R87  ValueDisplayed: 330k  [0402]  (hidden comment: RC0402FR-07330KL)
R88  ValueDisplayed: 220k  [0402]  (hidden comment: RC0402FR-07220KL)
R89  ValueDisplayed: 0  [0603]  (hidden comment: RC0603JR-070RL)
R90  ValueDisplayed: 1.00M  [0402]  (hidden comment: CRCW04021M00FKED)
R91  ValueDisplayed: 10k  [0402]  (hidden comment: CRCW040210K0JNED)
R92  ValueDisplayed: 10k  [0402]  (hidden comment: CRCW040210K0JNED)
TP4  5001  Display: DNC  [Keystone5001]  (no BOM)
TP5  5001  Dispaly: DNC  [Keystone5001]  (no BOM)
TP6  5001  Dispaly: DNC  [Keystone5001]  (no BOM)
TP7  5001  Dispaly: DNC  [Keystone5001]  (no BOM)
TP8  5001  Dispaly: DNC  [Keystone5001]  (no BOM)
TP9  5001  Dispaly: DNC  [Keystone5001]  (no BOM)
TP10  5001  Dispaly: DNC  [Keystone5001]  (no BOM)
USB2  1051640001  [Molex_1051640001]

### Nets
XDS_GND: C53.2 C54.2 C55.2 C56.2 IC3.3(GND) IC4.4(GND) IC4.9(PAD) R86.2 R88.1 R90.1 TP4.1
XDS_VCC: C56.1 IC4.1(OUT) R91.1 R92.1 TP10.1
IRSTN: TP9.1
ITCK: R92.2 TP6.1
ITDI: TP8.1
ITDO: TP7.1
ITMS: R91.2 TP5.1
VBUS_DETECT: R87.2 R88.2
XDS_DM: IC3.5(IO4) USB2.2(D-)
XDS_DP: IC3.4(IO3) USB2.3(D+)
XDS_ID: IC3.2(IO2) USB2.4(ID)
XDS_VBUS: C53.1 C55.1 IC3.6(VCC) IC4.5(EN) IC4.8(IN) R87.1 R89.2
NetC54_1: C54.1 IC3.1(IO1) R90.2 USB2.6 USB2.7 USB2.8 USB2.9 USB2.10 USB2.11
NetR86_1: R86.1 USB2.5(GND)
NetR89_1: R89.1 USB2.1(VBUS)

Not connected (* = marked no-connect by the designer): IC4 2(NC) 3(NR) 6(NC) 7(NC)

### Layout directives
differential pair: XDS_DM, XDS_DP

### Notes on the sheet
- Drawn By:
- SVN Rev:
- Number:
- TID #:
- Orderable:
- Rev:
- Sheet Title:
- File:
- Project Title:
- Designed for:
- Assembly Variant:
- Mod. Date:
- Sheet:
- Size:
- of
- B
- http://www.ti.com
- Texas Instruments and/or its licensors do not warrant the accuracy or completeness of this specification or any information contained therein. Texas Instruments and/or its licensors do not warrant that this design will meet the specifications, will be suitable for your application or fit for any particular purpose, or will operate in an implementation. Texas Instruments and/or its licensors do not warrant that the design is production worthy. You should completely validate and test your design implementation to confirm the system functionality for your application.
- Engineer:
- Contact:
- © Texas Instruments

### Library data of the parts
C53 = CMP-0006906-5: CAP, CERM, 2.2 uF, 10 V, +/- 10%, X5R, 0603; Manufacturer: Kemet; TaMin_C: -55°C; Polarized: N; SizeAreaWB_mm2: 4.68; Value1: Unknown; U/M: EA; Value: 2.2uF; TaMax_C: 85°C; SizeZ_mm: 1; SizeX_mm: 1.6; SizeY_mm: 0.8; SizeArea_mm2: 1.28; Cap_F: 2.2µF; AEC Category: Q200; Publisher: Texas Instruments; TempCo: X5R; Published: 2008-06-19; RoHS: Y; MountType: SMT; Supplier 1: Digi-Key; PackageReference: 0603; Tolerance_%: 10%; Cap_Case: 0603; Value2: 10V; CompType: Capacitor; LatestRevisionDate: 2017-03-09; PartNumber: C0603C225K8PACTU; AEC Qualified: ?; ComponentLink1Description: Datasheet link; Supplier Part Number 1: 399-4911-1-ND; Technology: Ceramic; ComponentLink1URL: http://www.kemet.com/kemet/web/homepage/kechome.nsf/vapubfiles/F3102_Y5V.pdf/$file/F3102_Y5V.pdf; Supplier 2: Mouser; Supplier 3: Farnell; Supplier Part Number 2: 80-C0603C225K8P; Supplier Part Number 3: 1108322
C54 = CMP-0006688-2: CAP, CERM, 3300 pF, 50 V, +/- 10%, X7R, 0402; Manufacturer: MuRata; TaMin_C: -55°C; Polarized: N; SizeAreaWB_mm2: 3; Value1: Unknown; U/M: EA; Value: 3300pF; TaMax_C: 125°C; SizeZ_mm: 0.6; SizeX_mm: 1; SizeY_mm: 0.5; Value2: 50V; Cap_F: 3.3nF; AEC Category: Q200; Supplier Part Number 2: 81-GRM36X332K50; Publisher: Texas Instruments; Supplier 2: Mouser; TempCo: X7R; Published: 2008-06-19; RoHS: Y; MountType: SMT; Supplier 1: Digi-Key; PackageReference: 0402; Tolerance_%: 10%; Cap_Case: 0402; SizeArea_mm2: 0.5; CompType: Capacitor; LatestRevisionDate: 2017-03-09; PartNumber: GRM155R71H332KA01D; AEC Qualified: ?; VDC_V: 50V; ComponentLink1Description: Datasheet link; Supplier Part Number 1: 490-3248-1-ND; Technology: Ceramic; ComponentLink1URL: http://search.murata.co.jp/Ceramy/PnsearchViewAction.do?HnOFG=ON&HnNFG=ON&SEL_CNT=50&sLang=en&sKey=GRM155R71H332KA01D&x=9&y=9&search=startwith
C55 = CMP-0006276-2: CAP, CERM, 1 uF, 25 V, +/- 10%, X5R, 0402; Manufacturer: TDK; TaMin_C: -55°C; Polarized: N; SizeAreaWB_mm2: 3; Value1: Unknown; U/M: EA; Value: 1uF; TaMax_C: 80°C; SizeZ_mm: 0.6; SizeX_mm: 1; SizeY_mm: 0.5; Value2: 25V; Cap_F: 1µF; AEC Category: Q200; ComponentLink1URL: https://product.tdk.com/info/en/catalog/datasheets/mlcc_commercial_general_en.pdf; Supplier Part Number 2: 07W9127; Publisher: Texas Instruments; Supplier 2: Newark; Supplier Part Number 3: 810-C1005X5R1E105K; TempCo: X5R; Supplier 3: Mouser; Published: 2008-06-19; RoHS: Y; MountType: SMT; Supplier 1: Digi-Key; PackageReference: 0402; Tolerance_%: 10%; Cap_Case: 0402; SizeArea_mm2: 0.5; CompType: Capacitor; PartNumber: C1005X5R1E105K050BC; AEC Qualified: N; VDC_V: 25V; ComponentLink1Description: Datasheet link; Supplier Part Number 1: 445-9066-1-ND; LatestRevisionDate: 2017-03-09; Technology: Ceramic; AEC Grade: N/A
C56 = CMP-0006543-2: CAP, CERM, 2.2 uF, 6.3 V, +/- 10%, X5R, 0402; Manufacturer: MuRata; TaMin_C: -55°C; Polarized: N; SizeAreaWB_mm2: 3; Value1: Unknown; U/M: EA; Value: 2.2uF; TaMax_C: 85°C; SizeZ_mm: 0.6; SizeX_mm: 1; SizeY_mm: 0.5; Value2: 6.3V; Cap_F: 2.2µF; AEC Category: Q200; Publisher: Texas Instruments; TempCo: X5R; Published: 2008-06-19; RoHS: Y; MountType: SMT; Supplier 1: Mouser; PackageReference: 0402; Tolerance_%: 10%; Cap_Case: 0402; SizeArea_mm2: 0.5; CompType: Capacitor; LatestRevisionDate: 2017-03-09; PartNumber: GRM155R60J225KE95D; AEC Qualified: N; VDC_V: 6.3V; ComponentLink1Description: Datasheet link; AEC Grade: N/A; Supplier Part Number 1: 81-GRM155R60J225KE5D; Technology: Ceramic; ComponentLink1URL: http://psearch.en.murata.com/capacitor/product/GRM155R60J225KE95%23.pdf
IC3 = CMP-0043115-1: ESD-Protection Array for High-Speed Data Interfaces, 4 Channels, -40 to +85 degC, 6-pin SON (DRY), Green (RoHS & no Sb/Br); Manufacturer: Texas Instruments; IO Leakage Current(nA): 1; USB High Speed: TRUE; IO Capacitance(Typ)(pF): 1.6; SubFamily: ESD Solution; IEC 61000-4-2 Contact(+/- kV): 8; Breakdown Voltage(Min)(V): 6; IEC 61000-4-2 Air-Gap(+/- kV): 12; PackageVersion: revF, Dec-2011; ComponentLink3URL: SamplesURL:http://www.ti.com/product/tpd4e004#samples; DatasheetVersion: SLVS729A; Eco-Plan: Green (RoHS & no Sb/Br); ComponentLink1Description: Manufacturer URL; Mounting Technology: Surface Mount; ComponentLink2URL: http://www.ti.com/general/docs/lit/getliterature.tsp?genericPartNumber=TPD4E004&fileType=pdf; ComponentLink1URL: http://www.ti.com/; PackageDescription: 6-Pin Plastic Small Outline No-Lead, 1 x 1.45 x 0.6 mm Body, 0.5 mm Pitch; 1394 / Firewire: TRUE; PackageReference: DRY0006A; ComponentLink3Description: URL Link1; ComponentLink2Description: Datasheet; Serial ATA / eSATA: TRUE; PartNumber: TPD4E004DRYR
IC4 = CMP-0036329-3: 500mA, Adjustable, Low Quiescent Current, Low-Noise, High-PSRR, Single-Output LDO Regulator, DRB0008A (VSON-8); Manufacturer: Texas Instruments; AEC Category: Q200; Vout Adj(Max)(V): 3.3; Vdo(Typ)(mV): 280; SizeY_mm: 3.0; Vin(Max)(V): 6.5; Accuracy(%): 2; Vin(Min)(V): 2.7; SizeAreaWB_mm2: 16.0; SizeZ_mm: 1.0; AEC Qualified: N; SizeArea_mm2: 9.0; Iout(Max)(A): 0.5; Rating: Catalog; Iq(Typ)(mA): 0.04; CompType: IC; MountType: SMT; PackageReference: DRB0008A; Fixed Output Options(V): 3.3; RoHS: Y; SizeX_mm: 3.0; ComponentLink2URL: http://www.ti.com/product/tps735; ComponentLink2Description: Product Folder; Operating Temperature Range: -40 to 125 C; PartNumber: TPS73533DRBT; ComponentLink3Description: Online Datasheet; ComponentLink1Description: Datasheet Link; ComponentLink1URL: http://www.ti.com/lit/ds/symlink/tps735.pdf; PackageDescription: VSON-8; Vout Adj(Min)(V): 3.3; ComponentLink3URL: http://www.ti.com/product/tps735/datasheet
R86 R89 = CMP-0025885-5: as R52 on sheet MCU098_04_XDS110-ET_EnergyTrace; Supplier Part Number 2: 603-RC0603JR-070RL; Supplier 2: Mouser; Supplier Part Number 3: 9233130; Supplier 3: Farnell; RoHS: Y; Value1: 5%; MountType: SMT; Supplier 1: Digi-Key; PackageReference: 0603; Tolerance_%: 5%; Res_ohm: 0; CompType: Resistor; PartNumber: RC0603JR-070RL; ComponentLink1Description: Datasheet link; Supplier Part Number 1: 311-0.0GRCT-ND; Technology: Thick Film; ComponentLink1URL: http://www.yageo.com/pdf/Pu-RC0603_51_PbFree_L_2.pdf; AEC Grade: N/A
R87 = CMP-0026731-1: RES, 330 k, 1%, 0.0625 W, 0402; Manufacturer: Yageo America; Power_W: 62.5mW; TempCo: 100 ppm/C; U/M: EA; Value: 330k; SizeX_mm: 1; SizeY_mm: 0.5; SizeZ_mm: 0.6; AEC Qualified: N; VDC_V: 50V; AEC Category: Q200; ComponentLink1URL: http://www.yageo.com/documents/recent/PYu-RC0402_51_RoHS_L_6_r.pdf; Supplier Part Number 2: 98K7541; Publisher: Texas Instruments; Supplier 2: Newark; Supplier Part Number 3: 603-RC0402FR-07330KL; Supplier 3: Mouser; Published: 2008-06-26; Value_Code: 330k; RoHS: Y; Value1: 1%; MountType: SMT; Supplier 1: Digi-Key; PackageReference: 0402; Tolerance_%: 1%; Res_ohm: 330k; Value2: 0.0625W; SizeArea_mm2: 0.5; CompType: Resistor; LatestRevisionDate: 2017-03-09; PartNumber: RC0402FR-07330KL; ComponentLink1Description: Datasheet link; AEC Grade: N/A; Supplier Part Number 1: 311-330KLRCT-ND; Technology: Thick Film
R88 = CMP-0026728-1: as R36 on sheet MCU098_04_XDS110-ET_EnergyTrace; ComponentLink1URL: http://www.yageo.com/documents/recent/PYu-RC0402_51_RoHS_L_6_r.pdf; Supplier Part Number 2: 98K7527; Publisher: Texas Instruments; Supplier 2: Newark; Supplier Part Number 3: 603-RC0402FR-07220KL; Supplier 3: Mouser; Published: 2008-06-26; Value_Code: 220k; RoHS: Y; Value1: 1%; MountType: SMT; Supplier 1: Digi-Key; PackageReference: 0402; Tolerance_%: 1%; Res_ohm: 220k; Value2: 0.0625W; SizeArea_mm2: 0.5; CompType: Resistor; LatestRevisionDate: 2017-03-09; PartNumber: RC0402FR-07220KL; ComponentLink1Description: Datasheet link; AEC Grade: N/A; Supplier Part Number 1: 311-220KLRCT-ND; Technology: Thick Film
R90 = CMP-0026100-1: RES, 1.00 M, 1%, 0.063 W, 0402; Manufacturer: Vishay-Dale; Power_W: 63mW; TempCo: 100 ppm/C; Value_Code: 1M00; U/M: EA; Value: 1.00Meg; EIA_Code: E96; Res_ohm: 1M; SizeX_mm: 1; SizeY_mm: 0.5; SizeZ_mm: 0.6; Value2: 0.063W; VDC_V: 50V; AEC Category: Q200; ComponentLink1URL: http://www.vishay.com/docs/20035/dcrcwe3.pdf; Supplier Part Number 2: 52K6593; Publisher: Texas Instruments; Supplier 2: Newark; Supplier Part Number 3: 71-CRCW0402-1.0M-E3; Supplier 3: Mouser; Published: 2008-06-26; RoHS: Y; Value1: 1%; MountType: SMT; Supplier 1: Digi-Key; PackageReference: 0402; Tolerance_%: 1%; SizeArea_mm2: 0.5; CompType: Resistor; LatestRevisionDate: 2017-03-09; PartNumber: CRCW04021M00FKED; AEC Qualified: ?; ComponentLink1Description: Datasheet link; Supplier Part Number 1: 541-1.00MLCT-ND; Technology: Thick Film
R91 R92 = CMP-0026825-4: RES, 10 k, 5%, 0.063 W, 0402; Manufacturer: Vishay-Dale; Power_W: 63mW; TempCo: 200 ppm/C; Value_Code: 10k0; U/M: EA; Value: 10k; EIA_Code: E24; SizeX_mm: 1; SizeY_mm: 0.5; SizeZ_mm: 0.6; Value2: 0.063W; VDC_V: 50V; AEC Category: Q200; Supplier Part Number 2: 59M6696; Publisher: Texas Instruments; Supplier 2: Newark; Supplier Part Number 3: 71-CRCW0402J-10K-E3; Supplier 3: Mouser; Published: 2008-06-26; RoHS: Y; Value1: 5%; MountType: SMT; Supplier 1: Digi-Key; PackageReference: 0402; Tolerance_%: 5%; Res_ohm: 10k; SizeArea_mm2: 0.5; CompType: Resistor; LatestRevisionDate: 2017-03-09; PartNumber: CRCW040210K0JNED; AEC Qualified: ?; ComponentLink1Description: Datasheet link; Supplier Part Number 1: 541-10KJCT-ND; Technology: Thick Film; ComponentLink1URL: http://www.vishay.com/docs/20035/dcrcwe3.pdf
TP4-TP10 = CMP-0055138-1: Test Point, Miniature, Black, TH; Manufacturer: Keystone; CNHeader: FALSE; Green_Lifecycle: Active; Green_REACh: Passed; ContactFinish: Silver; CT: TRUE; ComponentLink1URL: http://www.keyelco.com/userAssets/file/M60-2p60.pdf; Supplier Part Number 2: 534-5001; Publisher: Texas Instruments; Supplier 2: Mouser; Color: Black; RoHS: Y; MountType: TH; Green_EU RoHS-2: Incomplete; Supplier 1: Digi-Key; Green_EU RoHS: Passed; PackageReference: Black Miniature Testpoint; CompType: Test Point; LatestRevisionDate: 26/05/2017; PartNumber: 5001; ComponentLink1Description: Datasheet URL; Supplier Part Number 1: 36-5001-ND
USB2 = CMP-0055311-1: Receptacle, USB 2.0, Micro B, 5 Position, R/A, SMT; Manufacturer: Molex; CNHeader: FALSE; Current_A: 1.8A; Gender: Female; Voltage_V: 30V; Pitch_mm: 0.65; ContactFinish: Gold; CT: TRUE; Cert_UL: Y; ComponentLink1URL: http://www.molex.com/pdm_docs/sd/1051640001_sd.pdf; Supplier Part Number 2: 99Y3224; Publisher: Texas Instruments; Supplier 2: Newark; Supplier Part Number 3: 538-105164-0001; Color: Black; Supplier 3: Mouser; RoHS: Y; MountType: SMT; Supplier 1: Digi-Key; PackageReference: Receptacle, USB 2.0, Micro B, 5 Pos, 0.65mm Pitch, R/A, SMT; PinCount: 5; CompType: USB; LatestRevisionDate: 26/05/2017; PartNumber: 1051640001; Orientation: R/A; ComponentLink1Description: Datasheet URL; Supplier Part Number 1: WM11263CT-ND